# Altium schematic sheet 29 Other Pwr 1.SchDoc
size 420 x 297 mm
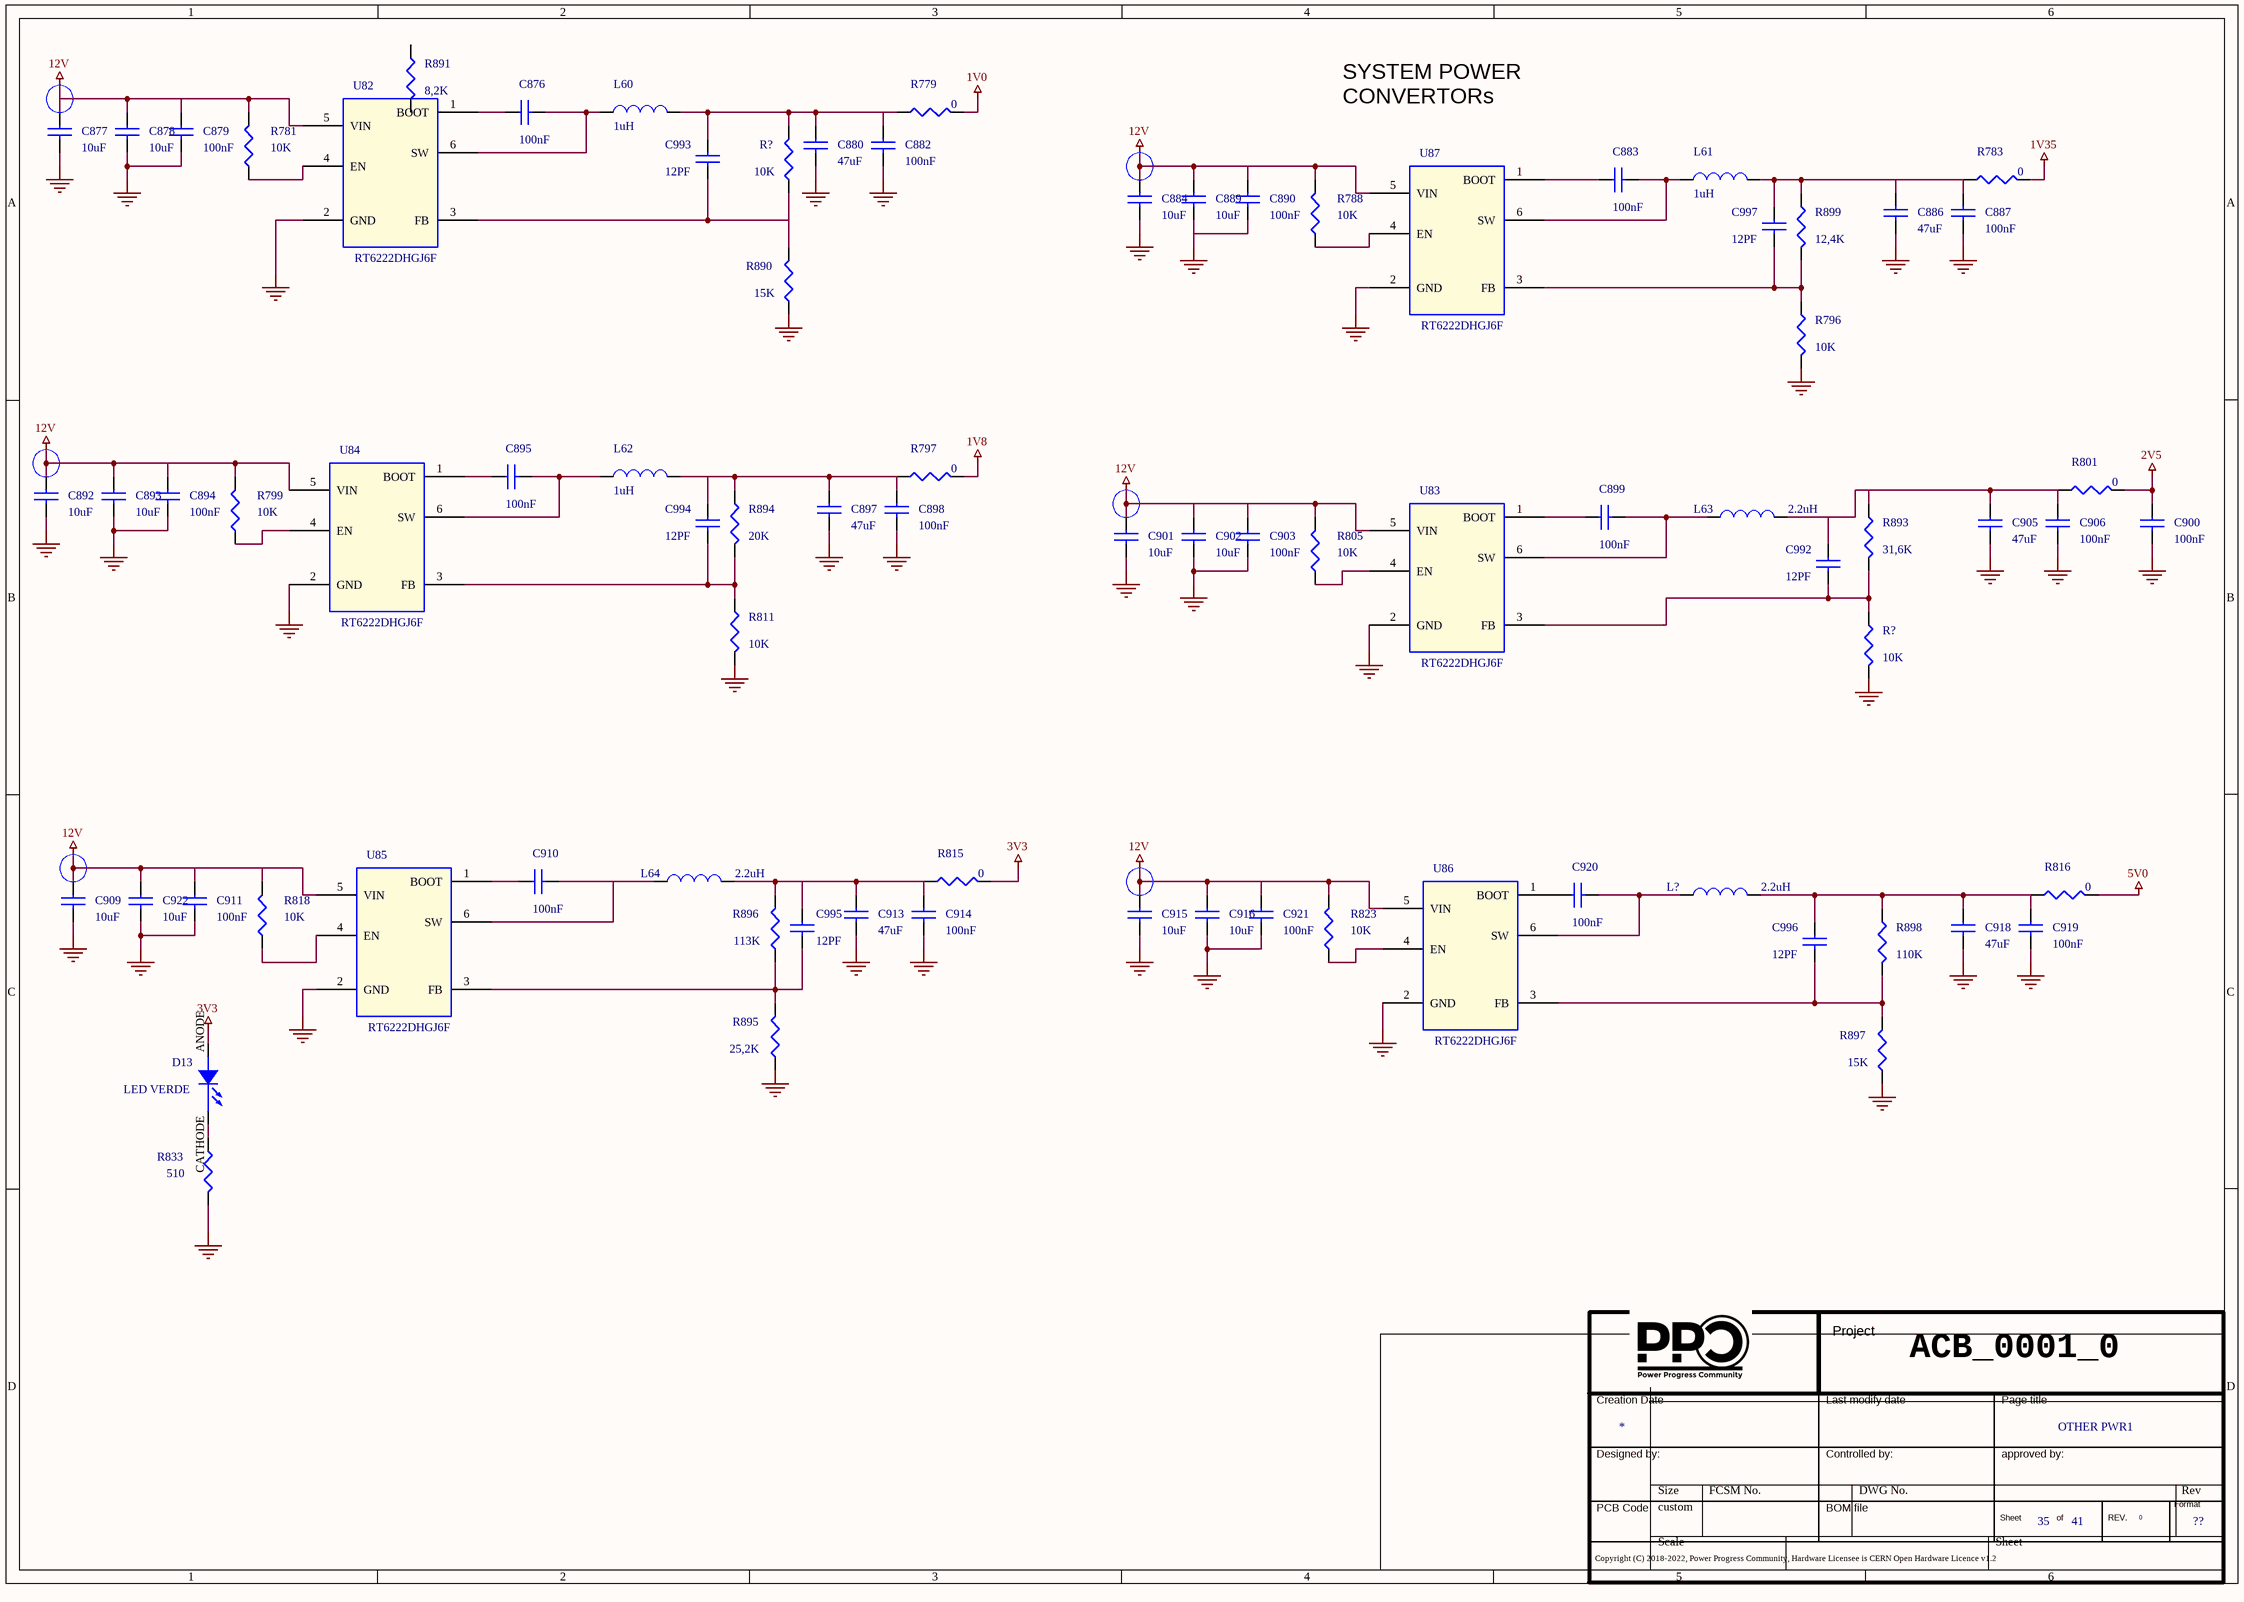
[diagram p0: 29 Other Pwr 1.SchDoc]

## Parts
(Parts that share a designator on the sheet are numbered #1, #2 ... from top to bottom, then left to right.)
*  Doc: OTHER PWR1  Page Count: 41  Page Number: 35  Page Size: ??  RevCode: 0  (hidden comment: Title_block_PPC)  (graphical)
C876  100nF  [SMD_0402]
C877  10uF  [SMD_0603]
C878  10uF  [SMD_0603]
C879  100nF  [SMD_0402]
C880  47uF  [SMD_0805]
C882  100nF  [SMD_0402]
C883  100nF  [SMD_0402]
C884  10uF  [SMD_0603]
C886  47uF  [SMD_0805]
C887  100nF  [SMD_0402]
C889  10uF  [SMD_0603]
C890  100nF  [SMD_0402]
C892  10uF  [SMD_0603]
C893  10uF  [SMD_0603]
C894  100nF  [SMD_0402]
C895  100nF  [SMD_0402]
C897  47uF  [SMD_0805]
C898  100nF  [SMD_0402]
C899  100nF  [SMD_0402]
C900  100nF  [SMD_0402]
C901  10uF  [SMD_0603]
C902  10uF  [SMD_0603]
C903  100nF  [SMD_0402]
C905  47uF  [SMD_0805]
C906  100nF  [SMD_0402]
C909  10uF  [SMD_0603]
C910  100nF  [SMD_0402]
C911  100nF  [SMD_0402]
C913  47uF  [SMD_0805]
C914  100nF  [SMD_0402]
C915  10uF  [SMD_0603]
C916  10uF  [SMD_0603]
C918  47uF  [SMD_0805]
C919  100nF  [SMD_0402]
C920  100nF  [SMD_0402]
C921  100nF  [SMD_0402]
C922  10uF  [SMD_0603]
C992  12PF  [SMD_0402]
C993  12PF  [SMD_0402]
C994  12PF  [SMD_0402]
C995  12PF  [SMD_0402]
C996  12PF  [SMD_0402]
C997  12PF  [SMD_0402]
D13  LED VERDE  [led_0603]
L60  1uH  [SMD]
L61  1uH  [SMD]
L62  1uH  [SMD]
L63  2.2uH  [SMD]
L64  2.2uH  [SMD]
L?  2.2uH  [SMD]
R779  0  [SMD_1206]
R781  10K  [SMD_0402]
R783  0  [SMD_1206]
R788  10K  [SMD_0402]
R796  10K  [SMD_0402]
R797  0  [SMD_1206]
R799  10K  [SMD_0402]
R801  0  [SMD_1206]
R805  10K  [SMD_0402]
R811  10K  [SMD_0402]
R815  0  [SMD_1206]
R816  0  [SMD_1206]
R818  10K  [SMD_0402]
R823  10K  [SMD_0402]
R833  510  [SMD_0402]
R890  15K  [SMD_0402]
R891  8,2K  [SMD_0402]
R893  31,6K  [SMD_0402]
R894  20K  [SMD_0402]
R895  25,2K  [SMD_0402]
R896  113K  [SMD_0402]
R897  15K  [SMD_0402]
R898  110K  [SMD_0402]
R899  12,4K  [SMD_0402]
R?#1  10K  [SMD_0402]
R?#2  10K  [SMD_0402]
U82  RT6222DHGJ6F
U83  RT6222DHGJ6F
U84  RT6222DHGJ6F
U85  RT6222DHGJ6F
U86  RT6222DHGJ6F
U87  RT6222DHGJ6F

## Nets
1V0: R779.2
1V8: R797.2
1V35: R783.2
2V5: C900.1 R801.2
3V3: D13.ANODE R815.2
5V0: R816.2
12V: C877.1 C878.1 C879.1 C884.1 C889.1 C890.1 C892.1 C893.1 C894.1 C901.1 C902.1 C903.1 C909.1 C911.1 C915.1 C916.1 C921.1 C922.1 R781.2 R788.2 R799.2 R805.2 R818.2 R823.2 U82.5(VIN) U83.5(VIN) U84.5(VIN) U85.5(VIN) U86.5(VIN) U87.5(VIN)
GND: C877.2 C878.2 C879.2 C880.2 C882.2 C884.2 C886.2 C887.2 C889.2 C890.2 C892.2 C893.2 C894.2 C897.2 C898.2 C900.2 C901.2 C902.2 C903.2 C905.2 C906.2 C909.2 C911.2 C913.2 C914.2 C915.2 C916.2 C918.2 C919.2 C921.2 C922.2 R796.2 R811.2 R833.1 R890.2 R895.2 R897.2 R?#2.2 U82.2(GND) U83.2(GND) U84.2(GND) U85.2(GND) U86.2(GND) U87.2(GND)
NetC876_1: C876.1 U82.1(BOOT)
NetC876_2: C876.2 L60.1 U82.6(SW)
NetC880_1: C880.1 C882.1 C993.1 L60.2 R779.1 R?#1.1
NetC883_1: C883.1 U87.1(BOOT)
NetC883_2: C883.2 L61.1 U87.6(SW)
NetC886_1: C886.1 C887.1 C997.1 L61.2 R783.1 R899.1
NetC895_1: C895.1 U84.1(BOOT)
NetC895_2: C895.2 L62.1 U84.6(SW)
NetC897_1: C897.1 C898.1 C994.1 L62.2 R797.1 R894.1
NetC899_1: C899.1 U83.1(BOOT)
NetC899_2: C899.2 L63.1 U83.6(SW)
NetC905_1: C905.1 C906.1 C992.1 L63.2 R801.1 R893.1
NetC910_1: C910.1 U85.1(BOOT)
NetC910_2: C910.2 L64.1 U85.6(SW)
NetC913_1: C913.1 C914.1 C995.1 L64.2 R815.1 R896.1
NetC918_1: C918.1 C919.1 C996.1 L?.2 R816.1 R898.1
NetC920_1: C920.1 U86.1(BOOT)
NetC920_2: C920.2 L?.1 U86.6(SW)
NetC992_2: C992.2 R893.2 R?#2.1 U83.3(FB)
NetC993_2: C993.2 R890.1 R?#1.2 U82.3(FB)
NetC994_2: C994.2 R811.1 R894.2 U84.3(FB)
NetC995_2: C995.2 R895.1 R896.2 U85.3(FB)
NetC996_2: C996.2 R897.1 R898.2 U86.3(FB)
NetC997_2: C997.2 R796.1 R899.2 U87.3(FB)
NetD13_CATHODE: D13.CATHODE R833.2
NetR781_1: R781.1 U82.4(EN)
NetR788_1: R788.1 U87.4(EN)
NetR799_1: R799.1 U84.4(EN)
NetR805_1: R805.1 U83.4(EN)
NetR818_1: R818.1 U85.4(EN)
NetR823_1: R823.1 U86.4(EN)

Not connected (* = marked no-connect by the designer): R891 1 2

## Notes on the sheet
- SYSTEM POWER
  CONVERTORs
- ACB_0001_0
- (in symbol Title_block_PPC) Project; Creation Date; Last modify date; Page title; Designed by:; Controlled by:; approved by:; Format; PCB Code; BOM file; Sheet; of; REV.; Copyright (C) 2018-2022, Power Progress Community, Hardware Licensee is CERN Open Hardware Licence v1.2

## Library data of the parts
* = Title_block_PPC: Title: T2080PCIe; Author: MICETEK; Page Create Date: March  8, 1995; Page Title: ?; Page Modify Date: *
C876 C879 C882 C890 C894 C895 C900 C903 C906 C910 C911 C920 C921 = CAP NP_Dup3: COND.CER. 100NF 50V 0402 X7R SMD; Manufacturer Part Number 1: CGA2B3X7R1H104M050BD; Manufacturer 1: TDK; Part Number: PASSIVE_24; RSM: RC0402; PCB Footprint: SMD_0402; Part Type: Capacitors\Ceramic\SMD\0402
C877 C878 C889 C892 C893 C901 C902 C909 C915 C916 C922 = CAP NP_Dup3: COND.CER.10uF 0603 25V SMD; Manufacturer Part Number 1: CL10A106MA8NRNC; Manufacturer 1: SAMSUNG; Part Number: PASSIVE_124; RSM: RC0603; Part Type: Capacitors\Ceramic\SMD\0603; PCB Footprint: SMD_0603
C880 C905 = CAP NP_Dup3: CAP CER 47UF 10V 20% X5R 0805; Manufacturer Part Number 1: JMK212BJ476MG-T; Manufacturer 1: Taiyo Yuden; Part Number: PASSIVE_244; RSM: RC0805; PCB Footprint: SMD_0805; Part Type: Capacitors\Ceramic\SMD\0805
C883 C887 C898 C899 C914 C919 = CAP NP_Dup3: COND.CER. 100NF 50V 0402 X7R SMD; Part Number: PASSIVE_24; Manufacturer 1: TDK; Manufacturer Part Number 1: CGA2B3X7R1H104M050BD; RSM: RC0402; PCB Footprint: SMD_0402; Part Type: Capacitors\Ceramic\SMD\0402
C884 = CAP NP_Dup3: COND.CER.10uF 0603 25V SMD; Part Number: PASSIVE_124; Manufacturer 1: SAMSUNG; Manufacturer Part Number 1: CL10A106MA8NRNC; RSM: RC0603; Part Type: Capacitors\Ceramic\SMD\0603; PCB Footprint: SMD_0603
C886 C897 C913 C918 = CAP NP_Dup3: CAP CER 47UF 10V 20% X5R 0805; Part Number: PASSIVE_244; Manufacturer 1: Taiyo Yuden; Manufacturer Part Number 1: JMK212BJ476MG-T; RSM: RC0805; PCB Footprint: SMD_0805; Part Type: Capacitors\Ceramic\SMD\0805
C992 C993 C996 C997 = CAP NP: COND.CER.12PF 50V 0402 NPO/COG SMD; Manufacturer Part Number 1: GRM1555C1H120JZ01D; Manufacturer 1: MURATA; Part Number: PASSIVE_36; RSM: RC0402; PCB Footprint: SMD_0402; Distributor 1: MURATA ELETTRONICA SPA; Part Type: Capacitors\Ceramic\SMD\0402
C994 C995 = CAP NP: COND.CER.12PF 50V 0402 NPO/COG SMD; Part Number: PASSIVE_36; Manufacturer 1: MURATA; Manufacturer Part Number 1: GRM1555C1H120JZ01D; RSM: RC0402; PCB Footprint: SMD_0402; Part Type: Capacitors\Ceramic\SMD\0402; Distributor 1: MURATA ELETTRONICA SPA
D13 = LED_1: LED CHIPLED VERDE 40mcd 570nm; Manufacturer Part Number 1: 598-8070-107F; Manufacturer 1: DIALIGHT; Part Number: DISCRETE_31; PCB Footprint: SMD_0603; RSM: LED0603-AK; Distributor 1: MOUSER(645-598-8070-107F); Part Type: Diodes\LED; TYPE: LED
L60-L62 = INDUCTOR_Dup1: FIXED IND 1UH 11A 16.5 Mohm SMD; Part Number: PASSIVE_1467; Manufacturer 1: Vishay; Manufacturer Part Number 1: IHLP2525CZER1R0M01; RSM: IND-VISHAY-IHLP2525; PCB Footprint: SMD; Part Type: Inductors\SMD\IHLP2525
L63 L64 = INDUCTOR_Dup1: FIXED IND 2.2UH 7A 16.5 Mohm SMD; Manufacturer Part Number 1: IHLP2525CZER2R2M1; Manufacturer 1: Vishay; Part Number: PASSIVE_513; RSM: IND-VISHAY-IHLP2525; PCB Footprint: SMD; Part Type: Inductors\SMD\IHLP2525
L? = INDUCTOR_Dup1: FIXED IND 2.2UH 7A 16.5 Mohm SMD; Part Number: PASSIVE_513; Manufacturer 1: VISHAY; Manufacturer Part Number 1: IHLP2525CZER2R2M1; PCB Footprint: SMD; Part Type: Inductors\SMD\IHLP2525
R779 R801 = R_Dup6: RESIS. 0R 1/4W 1206 SMD E96; Manufacturer Part Number 1: RC1206JR-070RL; Manufacturer 1: YAGEO; Part Number: PASSIVE_1266; RSM: RC1206; PCB Footprint: SMD_1206; Part Type: Resistors\Fixed\SMD\1206\5%
R781 R788 R796 R799 R805 R811 R818 R823 = R_Dup6: RESIS.CHIP 10K 1% 0402 SMD; Manufacturer 1: ROYAL OHM; Part Number: PASSIVE_584; RSM: RC0402; Manufacturer Part Number 1: RESIS.CHIP 10K 1% 0402 SMD; Part Type: Resistors\Fixed\SMD\0402\1%; PCB Footprint: SMD_0402
R783 R797 R815 R816 = R_Dup6: RESIS. 0R 1/4W 1206 SMD E96; Part Number: PASSIVE_1266; Manufacturer 1: YAGEO; Manufacturer Part Number 1: RC1206JR-070RL; RSM: RC1206; PCB Footprint: SMD_1206; Part Type: Resistors\Fixed\SMD\1206\5%
R833 = R_Dup6: RESIS.CHIP 510R 1% 0402 SMD; Part Number: PASSIVE_749; Manufacturer 1: ROYAL OHM; RSM: RC0402; PCB Footprint: SMD_0402; Part Type: Resistors\Fixed\SMD\0402\1%; Manufacturer Part Number 1: RESIS.CHIP 510R 1% 0402 SMD
R890 R897 = R: RESIS.CHIP 15K 1% 0402 SMD; Manufacturer 1: ROYAL OHM; Part Number: PASSIVE_614; PCB Footprint: SMD_0402; Distributor 1: CAMEL ELETTRONICA SRL  #; Manufacturer Part Number 1: RESIS.CHIP 15K 1% 0402 SMD; Part Type: Resistors\Fixed\SMD\0402\1%
R891 = R: RESIS. CHIP 8,2K 1% 0402 SMD; Manufacturer Part Number 1: RMC1/16SK8201FTH; Manufacturer 1: KAMAYA; Part Number: PASSIVE_786; RSM: RC0402; PCB Footprint: SMD_0402; Distributor 1: MODULI ELETTRONICI E COMPONENTI spa; Part Type: Resistors\Fixed\SMD\0402\1%
R893 = R: RESIS.CHIP 31K6 1% 0402 SMD; Part Number: PASSIVE_691; Manufacturer 1: ROYAL OHM; Manufacturer Part Number 1: RESIS.CHIP6K34 1% 0402 SMD; PCB Footprint: SMD_0402; Part Type: Resistors\Fixed\SMD\0402\1%; Distributor 1: CAMEL ELETTRONICA SRL  #
R894 = R: RESIS.CHIP 20K 1% 0402 SMD; Part Number: PASSIVE_641; Manufacturer 1: YAGEO; Manufacturer Part Number 1: RC0402FR-1320KL; PCB Footprint: SMD_0402; Part Type: Resistors\Fixed\SMD\0402\1%; Distributor 1: MOUSER(603-RC0402FR-1320KL)
R895 = R: RESIS.CHIP 25K2 1% 0402 SMD; Manufacturer 1: ROYAL OHM; Part Number: PASSIVE_657; PCB Footprint: SMD_0402; Distributor 1: CAMEL ELETTRONICA SRL  #; Manufacturer Part Number 1: RESIS.CHIP25K2 1% 0402 SMD; Part Type: Resistors\Fixed\SMD\0402\1%
R896 = R: RES 113K OHM 1/10W 1% 0402 SMD; Manufacturer Part Number 1: ERJ-2RKF1133X; Manufacturer 1: PANASONIC; Part Number: PASSIVE_1395; PCB Footprint: SMD_0402; Distributor 1: DIGIKEY(P113KLTR-ND); Part Type: Resistors\Fixed\SMD\0402\1%
R898 = R: RESIS.CHIP 110K 1% 0402 SMD; Manufacturer 1: ROYAL OHM; Part Number: PASSIVE_588; PCB Footprint: SMD_0402; Distributor 1: CAMEL ELETTRONICA SRL  #; Manufacturer Part Number 1: RESIS.CHIP 110K 1% 0402 SMD; Part Type: Resistors\Fixed\SMD\0402\1%
R899 = R: RESIS.CHIP 12,4K 1% 0402 SMD; Part Number: PASSIVE_591; Manufacturer 1: ROYAL OHM; PCB Footprint: SMD_0402; Part Type: Resistors\Fixed\SMD\0402\1%; Manufacturer Part Number 1: RESIS.CHIP 12,4K 1% 0402 SMD; Distributor 1: CAMEL ELETTRONICA SRL  #
R?#1 = R_Dup6: RESIS.CHIP 10K 1% 0402 SMD; Part Number: PASSIVE_584; Manufacturer 1: ROYAL OHM; PCB Footprint: SMD_0402; Part Type: Resistors\Fixed\SMD\0402\1%; Manufacturer Part Number 1: RESIS.CHIP 10K 1% 0402 SMD
R?#2 = R_Dup6: RESIS.CHIP 10K 1% 0402 SMD; Manufacturer 1: ROYAL OHM; Part Number: PASSIVE_584; PCB Footprint: SMD_0402; Manufacturer Part Number 1: RESIS.CHIP 10K 1% 0402 SMD; Part Type: Resistors\Fixed\SMD\0402\1%